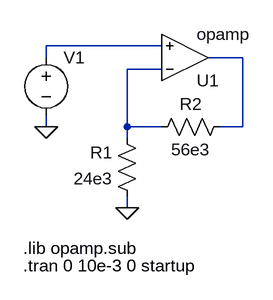
[diagram p0: schematic noninv-amplifier-dac-a2a3.asc]
noninv-amplifier-dac-a2a3.asc, the LTspice schematic file:
Version 4
SHEET 1 880 680
WIRE 448 96 288 96
WIRE 288 112 288 96
WIRE 560 112 512 112
WIRE 448 128 400 128
WIRE 288 208 288 192
WIRE 400 208 400 128
WIRE 448 208 400 208
WIRE 560 208 560 112
WIRE 560 208 528 208
WIRE 400 224 400 208
WIRE 400 320 400 304
FLAG 288 208 0
FLAG 400 320 0
SYMBOL OpAmps\\opamp 480 176 M180
SYMATTR InstName U1
SYMBOL voltage 288 96 R0
WINDOW 39 0 0 Left 0
WINDOW 3 24 96 Invisible 2
SYMATTR Value SINE(1.5 1.5 1e3)
SYMATTR InstName V1
SYMATTR Value2 AC 1
SYMBOL res 416 320 R180
WINDOW 0 36 76 Left 2
WINDOW 3 36 40 Left 2
SYMATTR InstName R1
SYMATTR Value 24e3
SYMBOL res 432 224 R270
WINDOW 0 32 56 VTop 2
WINDOW 3 0 56 VBottom 2
SYMATTR InstName R2
SYMATTR Value 56e3
TEXT 256 376 Left 2 !.lib opamp.sub
TEXT 256 400 Left 2 !.tran 0 10e-3 0 startup

The netlist it stands for:
* noninv-amplifier-dac-a2a3.asc
XU1 N003 N001 N002 opamp Aol=100K GBW=10Meg  ; pins invin noninvin out
V1 N001 0 SINE(1.5 1.5 1e3) AC 1
R1 0 N003 24e3
R2 N003 N002 56e3
.lib opamp.sub
.tran 0 10e-3 0 startup
.backanno
.end